# Altium schematic sheet SIM.SchDoc
size A
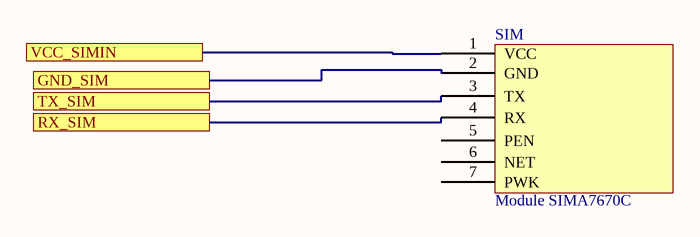
[diagram p0: SIM.SchDoc]

## Parts
SIM  Module SIMA7670C  [Module sim7670C]

## Ports
GND_SIM, RX_SIM, TX_SIM, VCC_SIMIN

## Nets
GND_SIM: SIM.2(GND) ; port GND_SIM
RX_SIM: SIM.4(RX) ; port RX_SIM
TX_SIM: SIM.3(TX) ; port TX_SIM
VCC_SIMIN: SIM.1(VCC) ; port VCC_SIMIN

Not connected (* = marked no-connect by the designer): SIM 5(PEN) 6(NET) 7(PWK)